# Altium project XIMUF407.PrjPcb
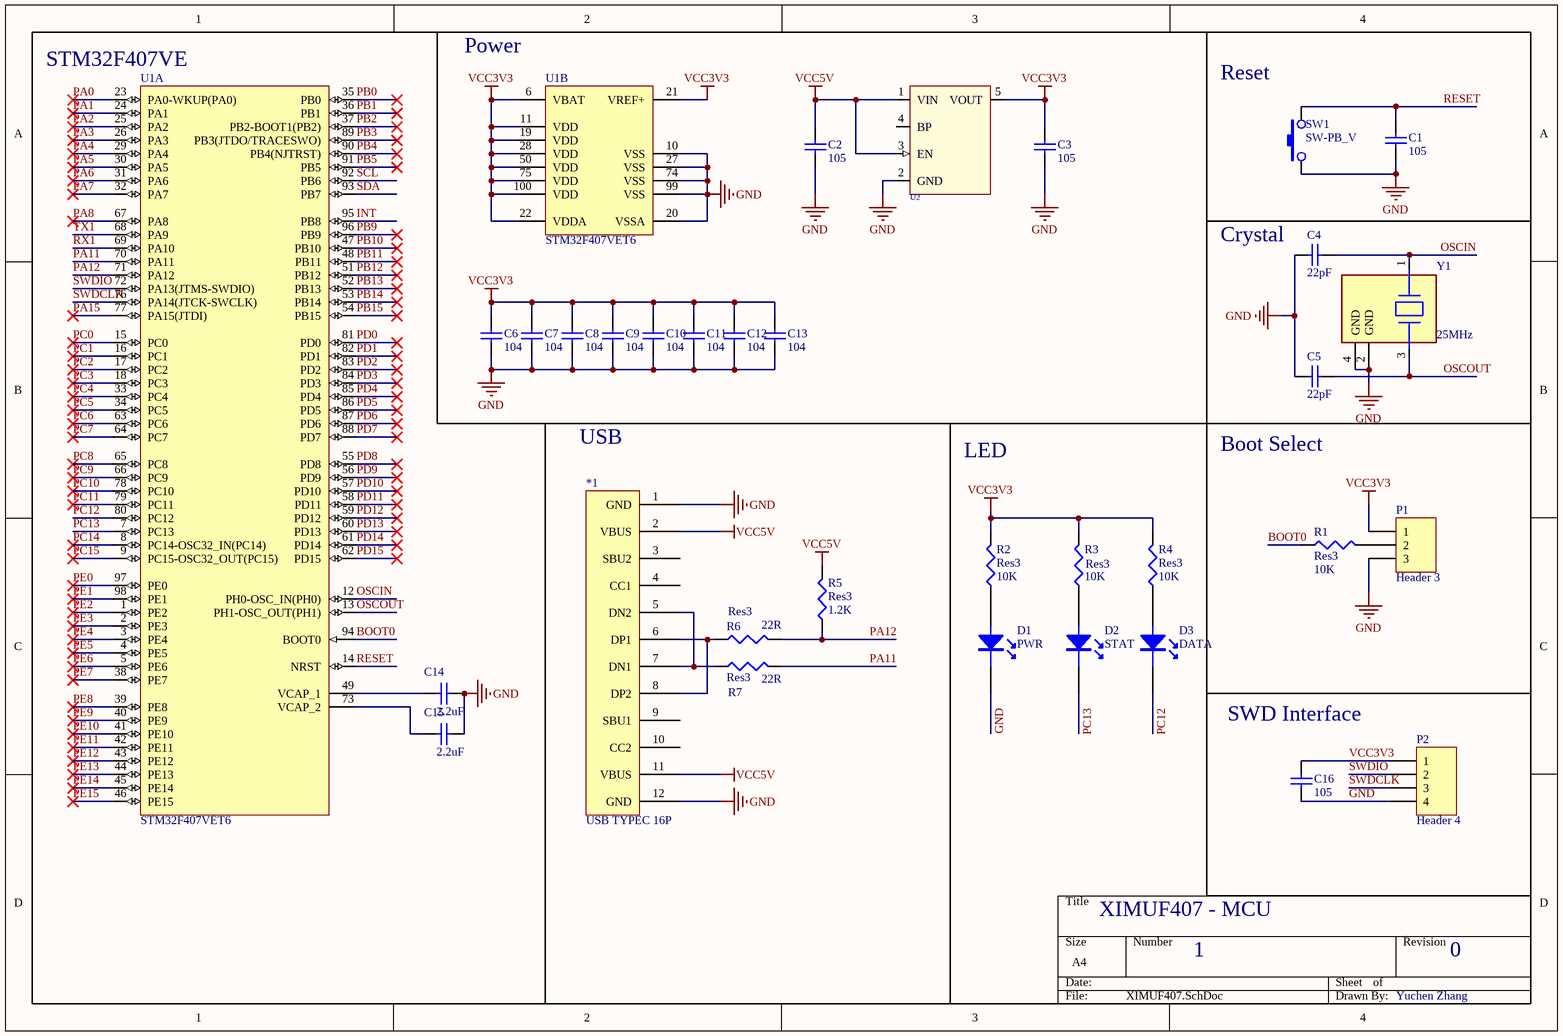
[diagram p0: XIMUF407.SchDoc]
2 sheets, 42 parts. Net scope: global (net labels, ports and power ports of the same name join across sheets).
Board file: XIMUF407.PcbDoc
Sheets:
  XIMUF407.SchDoc
  sensors.SchDoc

## Sheet XIMUF407.SchDoc
size A4

### Parts
*1  USB TYPEC 16P  [New footprint 1]
C1  105  [C 0603]
C2  105  [C 0603]
C3  105  [C 0603]
C4  22pF  [C 0603]
C5  22pF  [C 0603]
C6  104  [C 0603]
C7  104  [C 0603]
C8  104  [C 0603]
C9  104  [C 0603]
C10  104  [C 0603]
C11  104  [C 0603]
C12  104  [C 0603]
C13  104  [C 0603]
C14  2.2uF  [C 0603]
C15  2.2uF  [C 0603]
C16  105  [C 0603]
D1  PWR  [LED 0805G]
D2  STAT  [LED 0805G]
D3  DATA  [LED 0805G]
P1  Header 3  [HDR1X3]
P2  Header 4  [HDR1X4]
R1  Res3  value 10K  [J1-0603]
R2  Res3  value 10K  [J1-0603]
R3  Res3  value 10K  [J1-0603]
R4  Res3  value 10K  [J1-0603]
R5  Res3  value 1.2K  [J1-0603]
R6  Res3  value 22R  [J1-0603]
R7  Res3  value 22R  [J1-0603]
SW1  SW-PB_V  [TSW SMD-3*6*2.5]
U1  STM32F407VET6  [STM-LQFP100_M]  (parts A,B of 2)
U2  RT9193  [SOT23-5L]  (value not drawn)
Y1  25MHz  [FP-TSX-3225-MFG]

### Nets
GND: *1.1(GND) *1.12(GND) C1.1 C2.1 C3.1 C4.2 C5.2 C6.1 C7.1 C8.1 C9.1 C10.1 C11.1 C12.1 C13.1 C14.1 C15.1 C16.1 D1.2 P1.3 P2.4 SW1.1 U1.10(VSS) U1.20(VSSA) U1.27(VSS) U1.74(VSS) U1.99(VSS) U2.2(GND) Y1.2(GND) Y1.4(GND)
VCC3V3: C3.2 C6.2 C7.2 C8.2 C9.2 C10.2 C11.2 C12.2 C13.2 C16.2 P1.1 P2.1 R2.2 R3.2 R4.2 U1.6(VBAT) U1.11(VDD) U1.19(VDD) U1.21(VREF+) U1.22(VDDA) U1.28(VDD) U1.50(VDD) U1.75(VDD) U1.100(VDD) U2.5(VOUT)
VCC5V: *1.2(VBUS) *1.11(VBUS) C2.2 R5.2 U2.1(VIN) U2.3(EN)
BOOT0: R1.1 U1.94(BOOT0)
INT: U1.95(PB8)
OSCIN: C4.1 U1.12(PH0-OSC_IN(PH0)) Y1.1
OSCOUT: C5.1 U1.13(PH1-OSC_OUT(PH1)) Y1.3
PA0: U1.23(PA0-WKUP(PA0))
PA1: U1.24(PA1)
PA2: U1.25(PA2)
PA3: U1.26(PA3)
PA4: U1.29(PA4)
PA5: U1.30(PA5)
PA6: U1.31(PA6)
PA7: U1.32(PA7)
PA8: U1.67(PA8)
PA11: R7.2 U1.70(PA11)
PA12: R5.1 R6.2 U1.71(PA12)
PA15: U1.77(PA15(JTDI))
PB0: U1.35(PB0)
PB1: U1.36(PB1)
PB2: U1.37(PB2-BOOT1(PB2))
PB3: U1.89(PB3(JTDO/TRACESWO))
PB4: U1.90(PB4(NJTRST))
PB5: U1.91(PB5)
PB9: U1.96(PB9)
PB10: U1.47(PB10)
PB11: U1.48(PB11)
PB12: U1.51(PB12)
PB13: U1.52(PB13)
PB14: U1.53(PB14)
PB15: U1.54(PB15)
PC0: U1.15(PC0)
PC1: U1.16(PC1)
PC2: U1.17(PC2)
PC3: U1.18(PC3)
PC4: U1.33(PC4)
PC5: U1.34(PC5)
PC6: U1.63(PC6)
PC7: U1.64(PC7)
PC8: U1.65(PC8)
PC9: U1.66(PC9)
PC10: U1.78(PC10)
PC11: U1.79(PC11)
PC12: D3.2 U1.80(PC12)
PC13: D2.2 U1.7(PC13)
PC14: U1.8(PC14-OSC32_IN(PC14))
PC15: U1.9(PC15-OSC32_OUT(PC15))
PD0: U1.81(PD0)
PD1: U1.82(PD1)
PD2: U1.83(PD2)
PD3: U1.84(PD3)
PD4: U1.85(PD4)
PD5: U1.86(PD5)
PD6: U1.87(PD6)
PD7: U1.88(PD7)
PD8: U1.55(PD8)
PD9: U1.56(PD9)
PD10: U1.57(PD10)
PD11: U1.58(PD11)
PD12: U1.59(PD12)
PD13: U1.60(PD13)
PD14: U1.61(PD14)
PD15: U1.62(PD15)
PE0: U1.97(PE0)
PE1: U1.98(PE1)
PE2: U1.1(PE2)
PE3: U1.2(PE3)
PE4: U1.3(PE4)
PE5: U1.4(PE5)
PE6: U1.5(PE6)
PE7: U1.38(PE7)
PE8: U1.39(PE8)
PE9: U1.40(PE9)
PE10: U1.41(PE10)
PE11: U1.42(PE11)
PE12: U1.43(PE12)
PE13: U1.44(PE13)
PE14: U1.45(PE14)
PE15: U1.46(PE15)
RESET: C1.2 SW1.2 U1.14(NRST)
RX1: U1.69(PA10)
SCL: U1.92(PB6)
SDA: U1.93(PB7)
SWDCLK: P2.3 U1.76(PA14(JTCK-SWCLK))
SWDIO: P2.2 U1.72(PA13(JTMS-SWDIO))
TX1: U1.68(PA9)
Net*1_5: *1.5(DN2) *1.7(DN1) R7.1
Net*1_6: *1.6(DP1) *1.8(DP2) R6.1
NetC14_2: C14.2 U1.49(VCAP_1)
NetC15_2: C15.2 U1.73(VCAP_2)
NetD1_1: D1.1 R2.1
NetD2_1: D2.1 R3.1
NetD3_1: D3.1 R4.1
NetP1_2: P1.2 R1.2

Not connected (* = marked no-connect by the designer): *1 3(SBU2) 4(CC1) 9(SBU1) 10(CC2); U2 4(BP)

### Notes on the sheet
- (near U1) STM32F407VE
- (near U1) Power
- (near SW1) Reset
- (near C4) Crystal
- USB
- LED
- Boot Select
- SWD Interface
- XIMUF407 - MCU
- 1
- 0
- Yuchen Zhang

### Library data of the parts
*1 = CMP-002-00073-3
C1-C5 C14-C16 = Cap: Value: 104; Published: 8-Jun-2000; LatestRevisionDate: 17-Jul-2002; LatestRevisionNote: Re-released for DXP Platform.; Publisher: Altium Limited
C6-C13 = Cap: Published: 8-Jun-2000; LatestRevisionDate: 17-Jul-2002; LatestRevisionNote: Re-released for DXP Platform.; Publisher: Altium Limited; Value: 104
D1-D3 = LED
P1 = Header 3: Header, 3-Pin; LatestRevisionDate: 17-Jul-2002; LatestRevisionNote: Re-released for DXP Platform.; Publisher: Altium Limited
P2 = Header 4: Header, 4-Pin; LatestRevisionDate: 17-Jul-2002; LatestRevisionNote: Re-released for DXP Platform.; Publisher: Altium Limited
R1-R7 = Res3: Resistor; Published: 8-Jun-2000; LatestRevisionDate: 29-May-2009; LatestRevisionNote: IPC-7351 Footprint Added.; PackageReference: J1-0603; Publisher: Altium Limited; PackageDescription: Chip Resistor
U1 = CMP-0243-00016-3: ARM Cortex-M4 32-bit MCU+FPU, 210 DMIPS, 512 kB Flash, 192 kB Internal RAM, 82 I/Os, 100-pin LQFP, -40 to 85 degC, Tray; Manufacturer: STMicroelectronics; Supply Voltage(Vcc) max (V): 3.6; Supply Voltage(Vcc) min (V): 1.8; I/Os (High Current): 82; FLASH Size (Prog) (kB): 512; Operating Frequency(F) (Processor speed) (MHz): 168; D/A Converter: 2x12-bit; Internal RAM Size (kB): 192; PackageReference: LQFP100; Core: ARM Cortex-M4; ComponentLink1URL: http://www.st.com/web/en/home.html; ComponentLink1Description: Manufacturer URL; DatasheetVersion: Rev. 4; Packing: Tray; Mounting Technology: Surface Mount; ComponentLink2Description: Datasheet; ComponentLink2URL: http://www.st.com/st-web-ui/static/active/en/resource/technical/document/datasheet/DM00037051.pdf; ComponentLink3Description: Package Specification; PartNumber: STM32F407VET6; PackageVersion: Rev. 1, 06/2013; PackageDescription: 100-Pin Low Profile Quad Flat Package, 14 x 14 mm Body, 0.5 mm Pitch; ComponentLink3URL: http://www.st.com/st-web-ui/static/active/en/resource/technical/document/data_brief/DM00071938.pdf
U2 = RT9193X_5P: ICA_MFR_NAME: RICHTEK; ICA_PARTNUM: $$2191094$$RT9193-15CU5; Part Number: TMP-13
Y1 = CMP-36405-000005-1: CRYSTAL 16.00 MHZ 9PF SMD; Manufacturer Part Number: TSX-3225 16.0000MF18X-AC0; Manufacturer: EPSON; Stability: 18ppm; Esr: 60Ω; Frequency: 16MHz; Tolerance: 10ppm; Series: TSX-3225; Temperature Range High: +85°C; ComponentLink2URL: https://support.epson.biz/td/api/doc_check.php?dl=brief_TSX-3225&lang=en; Temperature Range Low: -40°C; RoHS: TRUE; Lead Free: Yes; Mouser Description: CRYSTAL 16.00 MHZ 9PF SMD; Category: Crys; Temperature: -40°C to +85°C; Device Class L1: Passive Components; Height: 0.6mm; Octopart: https://octopart.com/tsx-3225+16.0000mf18x-ac0-epson-58756552; Automotive: No; Digikey Description: CRYSTAL 16.00 MHZ 9PF SMD; ComponentLink2Description: Datasheet; Load Capacitance: 9pF; Package: TSX-3225; Device Class L3: Crystals; Device Class L2: Crystals / Oscillators

## Sheet sensors.SchDoc
size A4
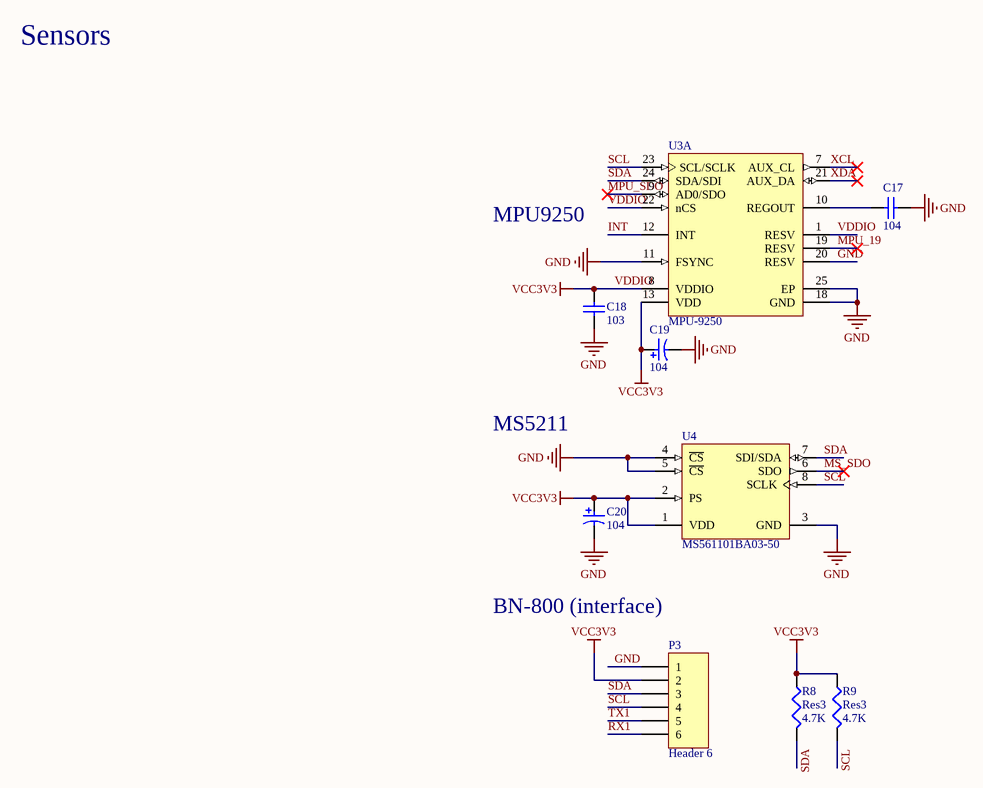
[diagram p1: sensors.SchDoc]

### Parts
C17  104  [C 0603]
C18  103  [C 0603]
C19  104  [AVX-1206-2-H1.8_L]
C20  104  [AVX-1206-2-H1.8_L]
P3  Header 6  [HDR1X6]
R8  Res3  value 4.7K  [J1-0603]
R9  Res3  value 4.7K  [J1-0603]
U3  MPU-9250  [INSE-QFN-24-1700X1540TP_M]  (part A of 2)
U4  MS561101BA03-50  [MSI-MS561101BA03-50-8_V]

### Nets
GND: C17.1 C18.1 C19.2 C20.2 P3.1 U3.11(FSYNC) U3.18(GND) U3.20(RESV) U3.25(EP) U4.3(GND) U4.4(~{CS}) U4.5(~{CS})
VCC3V3: C18.2 C19.1 C20.1 P3.2 R8.1 R9.1 U3.1(RESV) U3.8(VDDIO) U3.13(VDD) U3.22(nCS) U4.1(VDD) U4.2(PS)  [also labelled VDDIO]
INT: U3.12(INT)
MPU_19: U3.19(RESV)
MPU_SDO: U3.9(AD0/SDO)
MS_SDO: U4.6(SDO)
RX1: P3.6
SCL: P3.4 R9.2 U3.23(SCL/SCLK) U4.8(SCLK)
SDA: P3.3 R8.2 U3.24(SDA/SDI) U4.7(SDI/SDA)
TX1: P3.5
XCL: U3.7(AUX_CL)
XDA: U3.21(AUX_DA)
NetC17_2: C17.2 U3.10(REGOUT)

### Notes on the sheet
- Sensors
- MPU9250
- MS5211
- BN-800 (interface)

### Library data of the parts
C17 = Cap: Published: 8-Jun-2000; LatestRevisionDate: 17-Jul-2002; LatestRevisionNote: Re-released for DXP Platform.; Publisher: Altium Limited; Value: 104
C18 = Cap: Value: 104; Published: 8-Jun-2000; LatestRevisionDate: 17-Jul-2002; LatestRevisionNote: Re-released for DXP Platform.; Publisher: Altium Limited
C19 C20 = CMP-2000-07217-1: TAJ Series Standard Tantalum, 10 uF, +/- 10%, -55 to 125 degC, 2-Pin SMD (1206), RoHS, Tape and Reel; Manufacturer Size Code: A; Manufacturer: AVX; PCN Part Number: TAJSeriesSuffix08/Dec/2008; Voltage - Rated: 10V; Catalog Drawings: TAJSeriesSideTAJSeries; EDA / CAD Models: DownloadfromAcceleratedDesigns; Product Training Modules: ComponentSolutionsforSmartMeterApplications; ESR (Equivalent Series Resistance): 3Ohm; Type: Molded; Capacitance: 10µF; Other Names: 478-1654-6; Online Catalog: TAJSeries; Datasheet URL: https://datasheet.ciiva.com/26341/559409-da-01-en-tacc-a-3-2-mm-x-1-6-mm-x-1-6-mm-10-uf-26341749.pdf; Voltage Rating DC: 10V; Size / Dimension: 0.126"Lx0.063"W(3.20mmx1.60mm); Package / Case: 1206(3216Metric); Package Description: 2-Pin Chip Capacitor, Body 3.2 x 1.65 mm; Packaging: Digi-Reel®; Package Reference: 1206; Features: GeneralPurpose; Family: TantalumCapacitors; Height - Seated (Max): 0.071"(1.80mm); Category: Capacitors; Standard Package: 1; Tolerance: ±10%; Manufacturer URL: http://www.avx.com/; Mounting Technology: SurfaceMount; Operating Temperature: -55°C~125°C; Datasheet Version: 04/2013; Mounting Type: SurfaceMount; Lead Spacing: -; Series: TAJ; Lifetime @ Temp.: -
P3 = Header 6: Header, 6-Pin; LatestRevisionDate: 17-Jul-2002; LatestRevisionNote: Re-released for DXP Platform.; Publisher: Altium Limited
R8 R9 = Res3: Resistor; Published: 8-Jun-2000; LatestRevisionDate: 29-May-2009; LatestRevisionNote: IPC-7351 Footprint Added.; PackageReference: J1-0603; Publisher: Altium Limited; PackageDescription: Chip Resistor
U3 = CMP-2100-03657-1: 9-axis MotionTracking device, 2.4 to 3,6 V, -40 to 85 degC, 24-Pin QFN, RoHS, Tape and Reel; Manufacturer: InvenSense; Max Supply Voltage: 3.6V; Min Supply Voltage: 2.4V; Package Reference: QFN-24; Package Quantity: 1; Datasheet Version: Rev. 1.0, 01/2014; Case/Package: QFN; Package Description: 24-Pin Quad Flat No-lead Package, Body 3 x 3 mm, Pitch 0.4 mm; Datasheet URL: http://datasheet.octopart.com/MPU-9250-InvenSense-datasheet-21859386.pdf; RoHSCompliant: true; Max Operating Temperature: 85degC; Height: 1mm; Mount: SurfaceMount; Manufacturer URL: http://www.invensense.com/; Width: 3.1mm; Min Operating Temperature: -40degC; Length: 3.1mm
U4 = CMP-2000-05251-1: Barometric Pressure Sensor, with Stainless Steel Cap, 1.8 to 3.6 V, -45 to 85 degC, 8-Pin QFN, RoHS, Tape and Reel; Manufacturer: Measurement Specialties; Operating Pressure Max: 1200mbar; Supply Current: 12.5µA; Supply Voltage Max: 3.6V; Supply Voltage Min: 1.8V; No. of Pins: 8; Connection Size: 0.5mm; SVHC: NoSVHC(20-Jun-2013); Operating Pressure Min: 10mbar; Manufacturer URL: http://www.meas-spec.com/; Operating Temperature Min: -40degC; Pressure Type: Barometric; Package Reference: MS561101BA03-50-8; Datasheet URL: http://www.te.com/commerce/DocumentDelivery/DDEController?Action=srchrtrv&DocNm=MS5611-01BA03&DocType=Data+Sheet&DocLang=English&DocFormat=pdf&PartCntxt=CAT-BLPS0036; Package Description: 8-Pin Surface Mount Device, Body 5 x 3 mm, Pitch 1.25 mm; Sensor Case Style: QFN; Datasheet Version: Sep-15; Operating Temperature Max: 85degC

## Nets that join several sheets
GND: XIMUF407 (30 pins), sensors (12 pins)
VCC3V3: XIMUF407 (25 pins), sensors (12 pins)
INT: XIMUF407 (U1.95), sensors (U3.12)
RX1: XIMUF407 (U1.69), sensors (P3.6)
SCL: XIMUF407 (U1.92), sensors (P3.4 R9.2 U3.23 U4.8)
SDA: XIMUF407 (U1.93), sensors (P3.3 R8.2 U3.24 U4.7)
TX1: XIMUF407 (U1.68), sensors (P3.5)